# EAGLE schematic Charger (EAGLE 7.5.0)
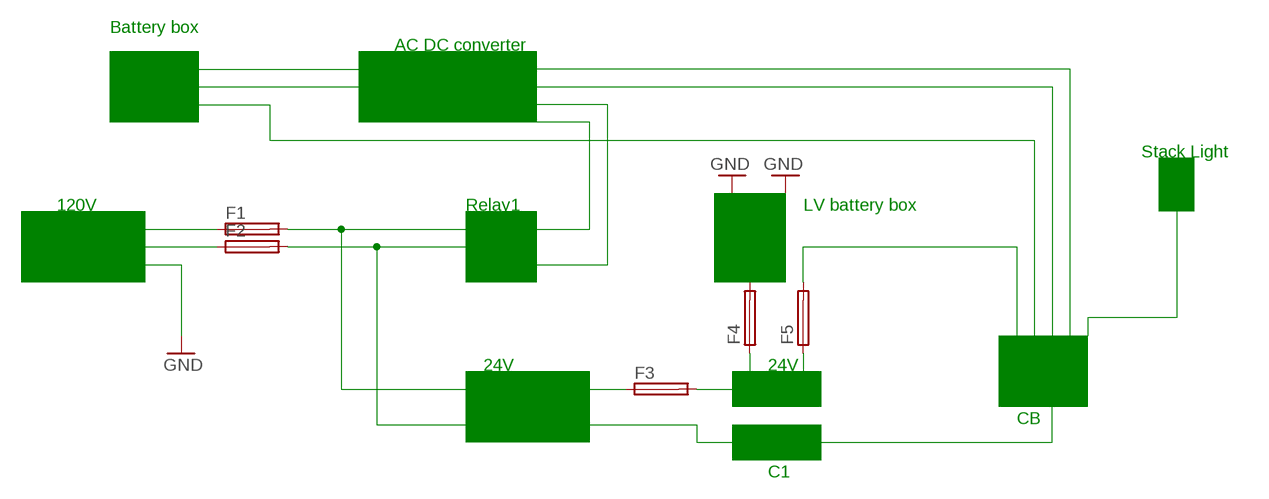
[diagram p0: schematic, sheet 1]

## Parts
F1  19559  [19559]
F2  19559  [19559]
F3  19559  [19559]
F4  19559  [19559]
F5  19559  [19559]

## Nets
N$1: F2.1
N$2: F1.1
N$3: F1.2
N$4: F2.2
N$5: F3.1
N$6: F3.2
N$8: F4.1
N$9: F5.1
N$15: F5.2
Unconnected: F4.2

## Notes on the sheet
- Battery box
- AC DC converter
- Stack Light
- 120V | Relay1 | LV battery box
- 120V | 120V
- 24V | 24V
- CB
- C1

## Library data of the parts
F1-F5 = fuse:19559: FUSE HOLDER TR5, Wickmann; MPN: 55900000001; OC_FARNELL: 9516360; OC_NEWARK: 02P0286

## Module 120V
Ports: 
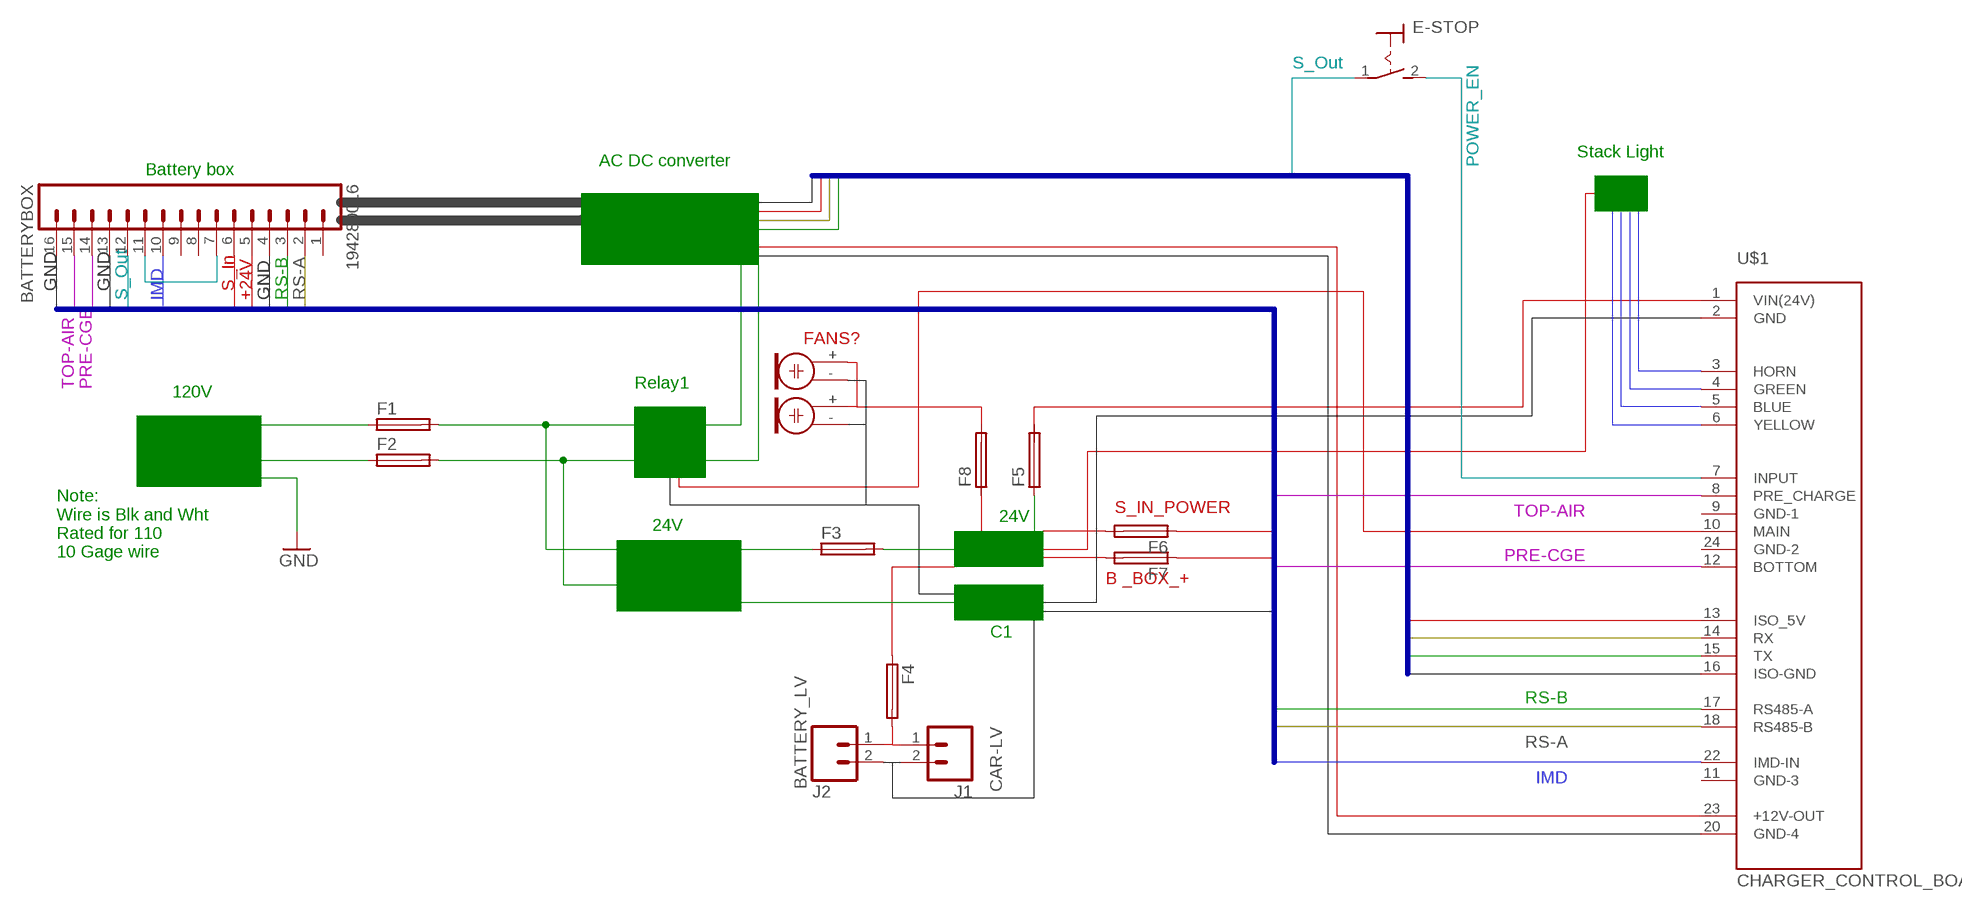
[diagram p1: schematic, module 120V, sheet 1]

### Parts
BATTERYBOX  194280016  M16_M_194280016  [19428-0016]
E-STOP  MS243  [MS243]
F1  19559  [19559]
F2  19559  [19559]
F3  19559  [19559]
F4  19559  [19559]
F5  19559  [19559]
F6  19559  [19559]
F7  19559  [19559]
F8  19559  [19559]
J1  CAR-LV  M2M1X2  [MOLEX-1X2]
J2  BATTERY_LV  M2M1X2  [MOLEX-1X2]
M1  ELECTRET_MICROPHON-TOM-1545P-R  [TOM-1545P-R]
M2  ELECTRET_MICROPHON-TOM-1545P-R  [TOM-1545P-R]
U$1  CHARGER_CONTROL_BOARD  [DMB-4772-A]

### Nets
N$1: F2.1
N$2: F1.1
N$3: F1.2
N$4: F2.2
N$5: F3.1
N$6: F3.2
N$9: F5.1
Unconnected: BATTERYBOX.1 BATTERYBOX.2 BATTERYBOX.3 BATTERYBOX.4 BATTERYBOX.5 BATTERYBOX.6 BATTERYBOX.7 BATTERYBOX.8 BATTERYBOX.9 BATTERYBOX.10 BATTERYBOX.11 BATTERYBOX.12 BATTERYBOX.13 BATTERYBOX.14 BATTERYBOX.15 BATTERYBOX.16 E-STOP.1(P) E-STOP.2(S) F4.1 F4.2 F5.2 F6.1 F6.2 F7.1 F7.2 F8.1 F8.2 J1.1 J1.2 J2.1 J2.2 M1.+ M1.- M2.+ M2.- U$1.1(VIN(24V)) U$1.2(GND) U$1.3(HORN) U$1.4(GREEN) U$1.5(BLUE) U$1.6(YELLOW) U$1.7(INPUT) U$1.8(PRE_CHARGE) U$1.9(GND-1) U$1.10(MAIN) U$1.11(GND-3) U$1.12(BOTTOM) U$1.13(ISO_5V) U$1.14(RX) U$1.15(TX) U$1.16(ISO-GND) U$1.17(RS485-A) U$1.18(RS485-B) U$1.20(GND-4) U$1.22(IMD-IN) U$1.23(+12V-OUT) U$1.24(GND-2)

### Buses
B$1
B$2

### Notes on the sheet
- S_Out
- Stack Light
- AC DC converter | POWER_EN
- Battery box
- GND | GND | S_In
- S_Out | IMD | +24V | GND | RS-B | RS-A
- FANS?
- TOP-AIR | PRE-CGE | Relay1
- 120V
- TOP-AIR
- S_IN_POWER
- 24V
- 24V
- PRE-CGE
- Note:
  Wire is Blk and Wht 
  Rated for 110
  10 Gage wire
- B _BOX_+
- C1
- RS-B
- RS-A
- IMD

### Library data of the parts
BATTERYBOX = FSAE Electric:M16; PARTNO: 0194280016
E-STOP = switch:MS243: TOGGLE SWITCH
F1-F8 = fuse:19559: FUSE HOLDER TR5, Wickmann; MPN: 55900000001; OC_FARNELL: 9516360; OC_NEWARK: 02P0286
J1 J2 = FSAE Electric:M2; PARTNO: 0022232021
M1 M2 = microphon:ELECTRET_MICROPHON-: Electret Condenser Microphone
U$1 = FSAE Electric:CHARGER_CONTROL_BOARD